# Altium schematic sheet Rectifier.SchDoc
size A
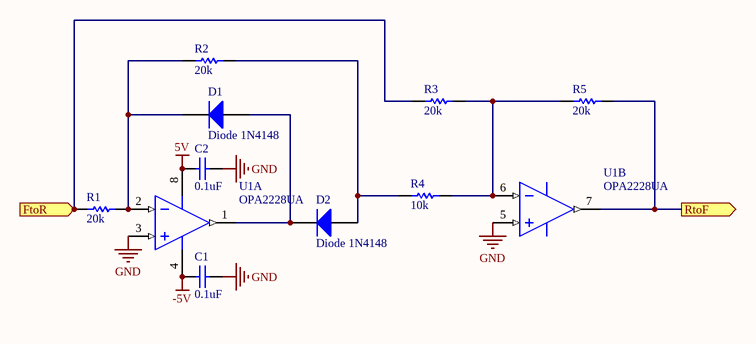
[diagram p0: Rectifier.SchDoc]

## Parts
C1  value 0.1uF  [RAD-0.3]  (hidden comment: Cap)
C2  value 0.1uF  [RAD-0.3]  (hidden comment: Cap)
D1  Diode 1N4148  [DO-35]
D2  Diode 1N4148  [DO-35]
R1  value 20k  [AXIAL-0.3]  (hidden comment: Res1)
R2  value 20k  [AXIAL-0.3]  (hidden comment: Res1)
R3  value 20k  [AXIAL-0.3]  (hidden comment: Res1)
R4  value 10k  [AXIAL-0.3]  (hidden comment: Res1)
R5  value 20k  [AXIAL-0.3]  (hidden comment: Res1)
U1  OPA2228UA  [TI-D8_N]  (parts A,B of 2)

## Ports
FtoR (in), RtoF (out)

## Nets
5V: C2.2 U1.8(V+)
-5V: C1.2 U1.4(V-)
GND: C1.1 C2.1 U1.3(IN_A+) U1.5(IN_B+)
FtoR: R1.2 R3.2 ; port FtoR
RtoF: R5.1 U1.7(OUT_B) ; port RtoF
NetD1_1: D1.1(A) D2.2(K) U1.1(OUT_A)
NetD1_2: D1.2(K) R1.1 R2.2 U1.2(IN_A-)
NetD2_1: D2.1(A) R2.1 R4.2
NetR3_1: R3.1 R4.1 R5.2 U1.6(IN_B-)

## Library data of the parts
C1 C2 = Cap: Capacitor; Published: 8-Jun-2000; LatestRevisionDate: 17-Jul-2002; LatestRevisionNote: Re-released for DXP Platform.; PackageReference: RAD-0.3; Publisher: Altium Limited; PackageDescription: Radial Cap, Thru-Hole; 2 Leads; 0.3 in Pin Spacing
D1 D2 = Diode 1N4148: High Conductance Fast Diode; Published: 8-Jun-2000; LatestRevisionDate: 17-Jul-2002; LatestRevisionNote: Re-released for DXP Platform.; DatasheetVersion: 1997; PackageReference: DO-35; Publisher: Altium Limited; PackageDescription: Diode, Axial; Body 3.8 x 1.9 mm (LxDia. max), Lead Dia. 0.53 mm (max); Code_JEDEC: DO-204-AH; ComponentLink1Description: Manufacturer Link; ComponentLink1URL: http://www.fairchildsemi.com/; ComponentLink2Description: Datasheet; ComponentLink2URL: http://www.fairchildsemi.com/ds/1N%2F1N4148.pdf
R1-R5 = Res1: Resistor; Published: 8-Jun-2000; LatestRevisionDate: 17-Jul-2002; LatestRevisionNote: Re-released for DXP Platform.; PackageReference: AXIAL-0.3; Publisher: Altium Limited; PackageDescription: Axial Device, Thru-Hole; 2 Leads; 0.3 in Pin Spacing
U1 = OPA2228UA: High Precision, Low Noise Operational Amplifier, 5 to 36 V, -55 to 125 degC, 8-pin SOIC (D8), Green (RoHS & no Sb/Br); Manufacturer: Texas Instruments; CMRR(Min)(dB): 120; GBW(Typ)(MHz): 33; IIB(Max)(pA): 10000; Iq per channel(Max)(mA): 3.8; Number of Channels: 2; Offset Drift(Typ)(uV/C): 0.3; Packing: TUBE; Rating: Catalog; Slew Rate(Typ)(V/us): 11; Sub Family: High Supply Voltage Amplifier (>=30V), Low Noise Amp (<=10nV/rtHz), Low Offset Voltage Amplifier (<=500uV), Precision Amplifier; Total Supply Voltage(Max)(+5V is 5, +/-5V is 10): 36; Total Supply Voltage(Min)(+5V is 5, +/-5V is 10): 5; Vio (25C)(Max)(mV): 0.2; DatasheetVersion: SBOS110A; PackageVersion: 4040047-3/M, 06/2011; PackageReference: D8; PackageDescription: 8-Pin Plastic Small Outline, Body 4.9 x 3.9 mm, Pitch 1.27 mm; Supplier 1: Digi-Key; Supplier Part Number 1: OPA2228UA-ND; Supplier 2: Farnell; Supplier Part Number 2: 1212434; Supplier 3: Newark; Supplier Part Number 3: 01M8390; Supplier 4: Newark; Supplier Part Number 4: 75C4643; Supplier 5: Mouser; Supplier Part Number 5: 595-OPA2228UA; Eco-Plan: Green (RoHS & no Sb/Br); Mounting Technology: Surface Mount; Code_JEDEC: MS-012; PartNumber: OPA2228UA; ComponentLink1Description: Manufacturer URL; ComponentLink1URL: http://www.ti.com/; ComponentLink2Description: Datasheet; ComponentLink2URL: http://www.ti.com/lit/ds/symlink/opa2228.pdf; ComponentLink3Description: Package Specification; ComponentLink3URL: http://www.ti.com/litv/pdf/msoi002j